# EAGLE design schema (EAGLE 7.7.0)
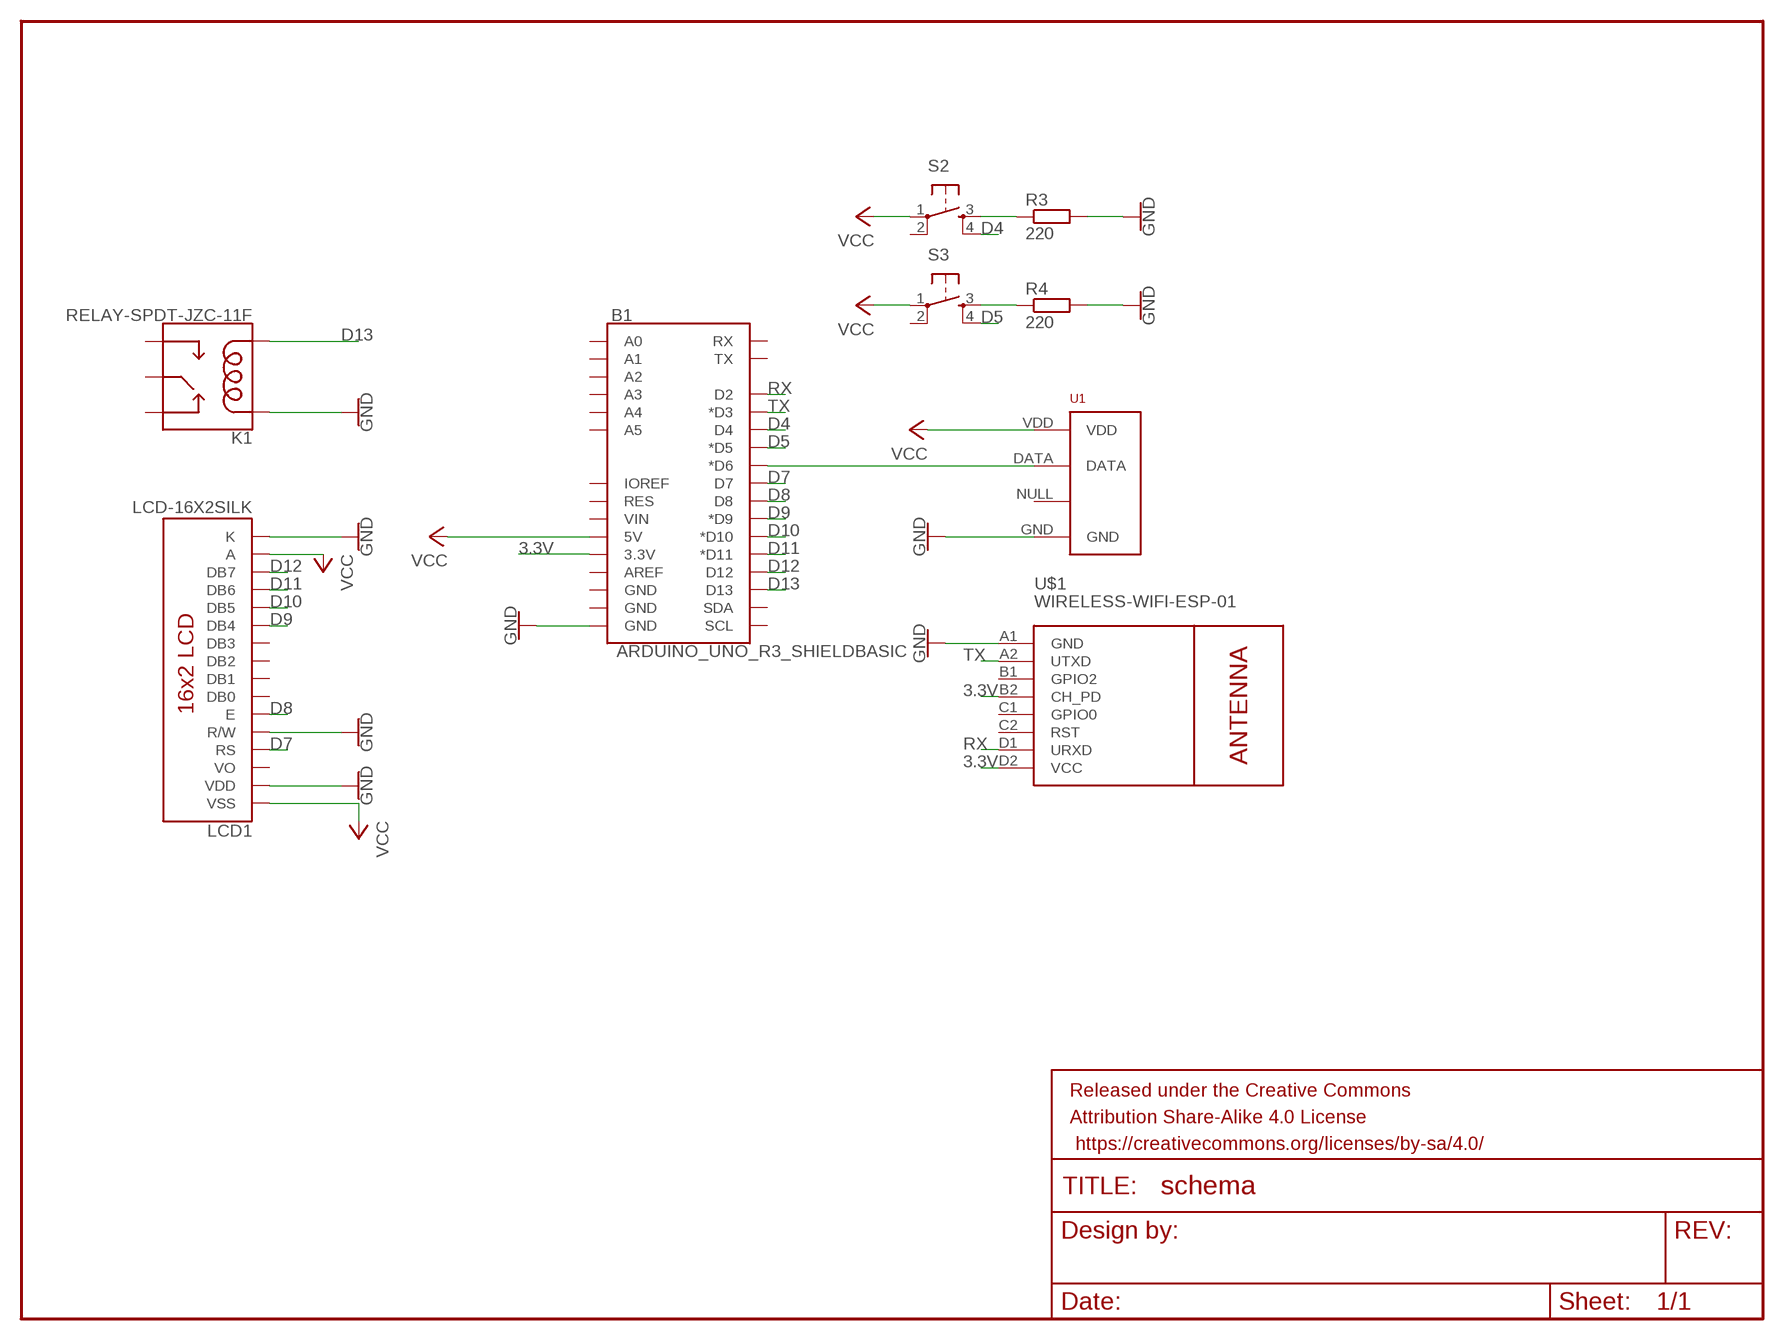
[diagram p0: schematic, sheet 1]

## Parts
B1  ARDUINO_UNO_R3_SHIELDBASIC  [UNO_R3_SHIELD]
FRAME1  FRAME-LETTER  [CREATIVE_COMMONS]
K1  RELAY-SPDT-JZC-11F  [RELAY-JZC]
LCD1  LCD-16X2SILK  [LCD-16X2]
R3  220  R-EU_0204/7  [0204/7]
R4  220  R-EU_0204/7  [0204/7]
S2  TAC_SWITCHPTH  [TACTILE-PTH]
S3  TAC_SWITCHPTH  [TACTILE-PTH]
U1  RHT03_DHT-22_AM2302RA  [RHT03_DHT-22/RA]
U$1  WIRELESS-WIFI-ESP-01  [WIRELESS-WIFI-ESP-01]

## Nets
3.3V: B1.3.3V U$1.B2(CH_PD) U$1.D2(VCC)
D4: B1.D4 S2.4
D5: B1.D5(*D5) S3.4
D7: B1.D7 LCD1.4(RS)
D8: B1.D8 LCD1.6(E)
D9: B1.D9(*D9) LCD1.11(DB4)
D10: B1.D10(*D10) LCD1.12(DB5)
D11: B1.D11(*D11) LCD1.13(DB6)
D12: B1.D12 LCD1.14(DB7)
D13: B1.D13 K1.1(COIL2)
GND: B1.GND@0(GND) K1.5(COIL1) LCD1.2(VDD) LCD1.5(R/W) LCD1.16(K) R3.2 R4.2 U1.GND U$1.A1(GND)
N$2: R3.1 S2.3
N$3: B1.D6(*D6) U1.DATA
N$4: R4.1 S3.3
N$5: S3.1 ; supply symbol labelled VCC
RX: B1.D2 U$1.D1(URXD)
TX: B1.D3(*D3) U$1.A2(UTXD)
VCC: B1.5V LCD1.1(VSS) LCD1.15(A) S2.1 U1.VDD
Unconnected: B1.A0 B1.A1 B1.A2 B1.A3 B1.A4 B1.A5 B1.AREF B1.GND@1(GND) B1.GND@2(GND) B1.IOREF B1.RES B1.RX B1.SCL B1.SDA B1.TX B1.VIN K1.2(NC) K1.3(NO) K1.4(MAIN) LCD1.3(VO) LCD1.7(DB0) LCD1.8(DB1) LCD1.9(DB2) LCD1.10(DB3) S2.2 S3.2 U1.NULL U$1.B1(GPIO2) U$1.C1(GPIO0) U$1.C2(RST)

## Library data of the parts
B1 = SparkFun-Boards:ARDUINO_UNO_R3_SHIELD: Arduino R3 Shield Footprint Shield form compatible with the Arduino Uno R3. SparkFun Products: MG2639 Cellular Shield <https://www.sparkfun.com/products/13120> MIDI Shield <https://www.sparkfun.com/products/12898> R3 Stackable Headers Kit <https://www.sparkfun.com/products/11417>
FRAME1 = SparkFun-Aesthetics:FRAME-LETTER: Schematic Frame - Letter Standard 8.5x11 US Letter frame
K1 = SparkFun-Electromechanical:RELAY-SPDT: SPDT Electromechanical Relay Single-pole, double-throw sealed relays. When current is applied to the coil, it throws a simple changeover switch, terminating the connection from the NC contact to ground and closing the NO contact. Use them to switch high voltage/high current devices. SparkFun Products JQX-15F: Relay SPDT Sealed - 20A <https://www.sparkfun.com/products/10924> (COM-10924) JZC-11F: Relay SPDT Sealed <https://www.sparkfun.com/products/100> (COM-00100); PROD_ID: COMP-09533; SF_SKU: COM-00100
LCD1 = SparkFun-Displays:LCD-16X2: Standard text-only 16x2 parallel input LCD Basic 16 character by 2 line display. Typically utilizes the extremely common HD44780 parallel interface chipset SparkFun Products: Basic 16x2 Green <https://www.sparkfun.com/products/255> Basic 8x2 Green <https://www.sparkfun.com/products/11122>; SF_ID: LCD-00255
R3 R4 = resistor:R-EU_: RESISTOR, European symbol
S2 S3 = SparkFun-Retired:TAC_SWITCH: Momentary Switch Button commonly used for reset or general input. Spark Fun Electronics SKU : COM-00097 SMT- SWCH-08247
U1 = RHT03_DHT-22_AM2302:RHT03_DHT-22_AM2302: RHT03 / DHT-22 / AM2302 Packages and symbol for the RHT03 / DHT-22 relative humidity and temperature sensor. Note: The AM2302 is a wired version of the DHT-22 which typically requires less clearance and is thus provided as a separate package.; PROD_ID: SEN-10167
U$1 = diy-modules:WIRELESS-WIFI-ESP-01: Wireless Wi-Fi ESP-01 Module based on ESP8266 chip Click here to find device on ebay.com <http://www.ebay.com/sch/esp8266+esp+01+transceiver>

## Board
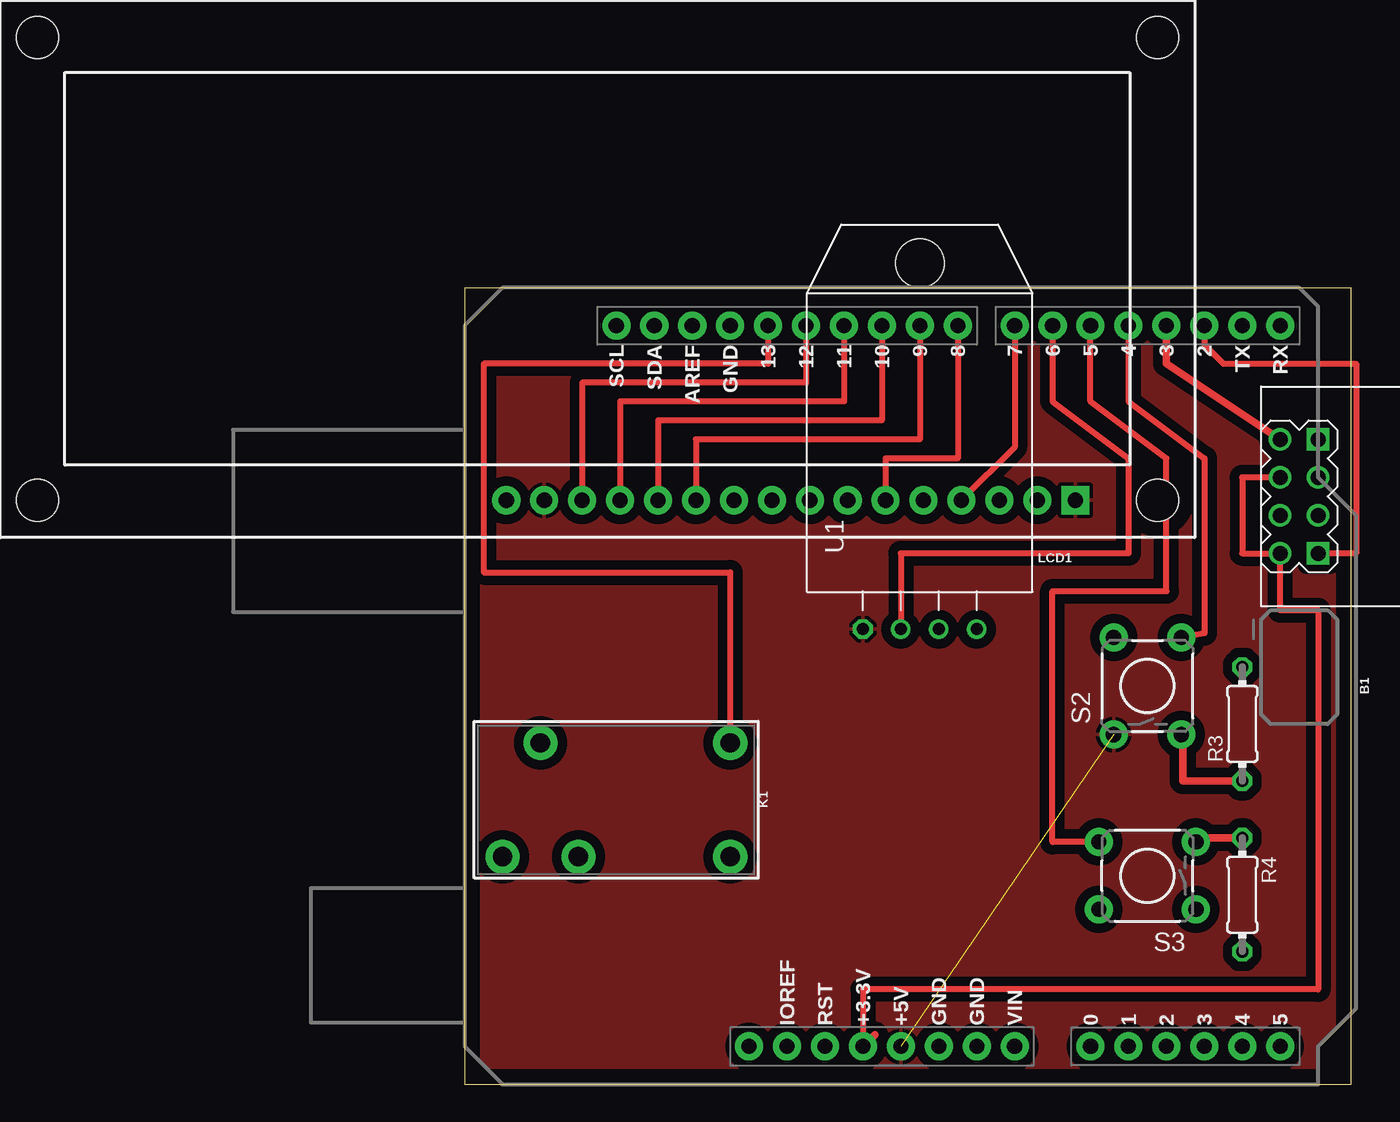
[diagram p1: board, top side]
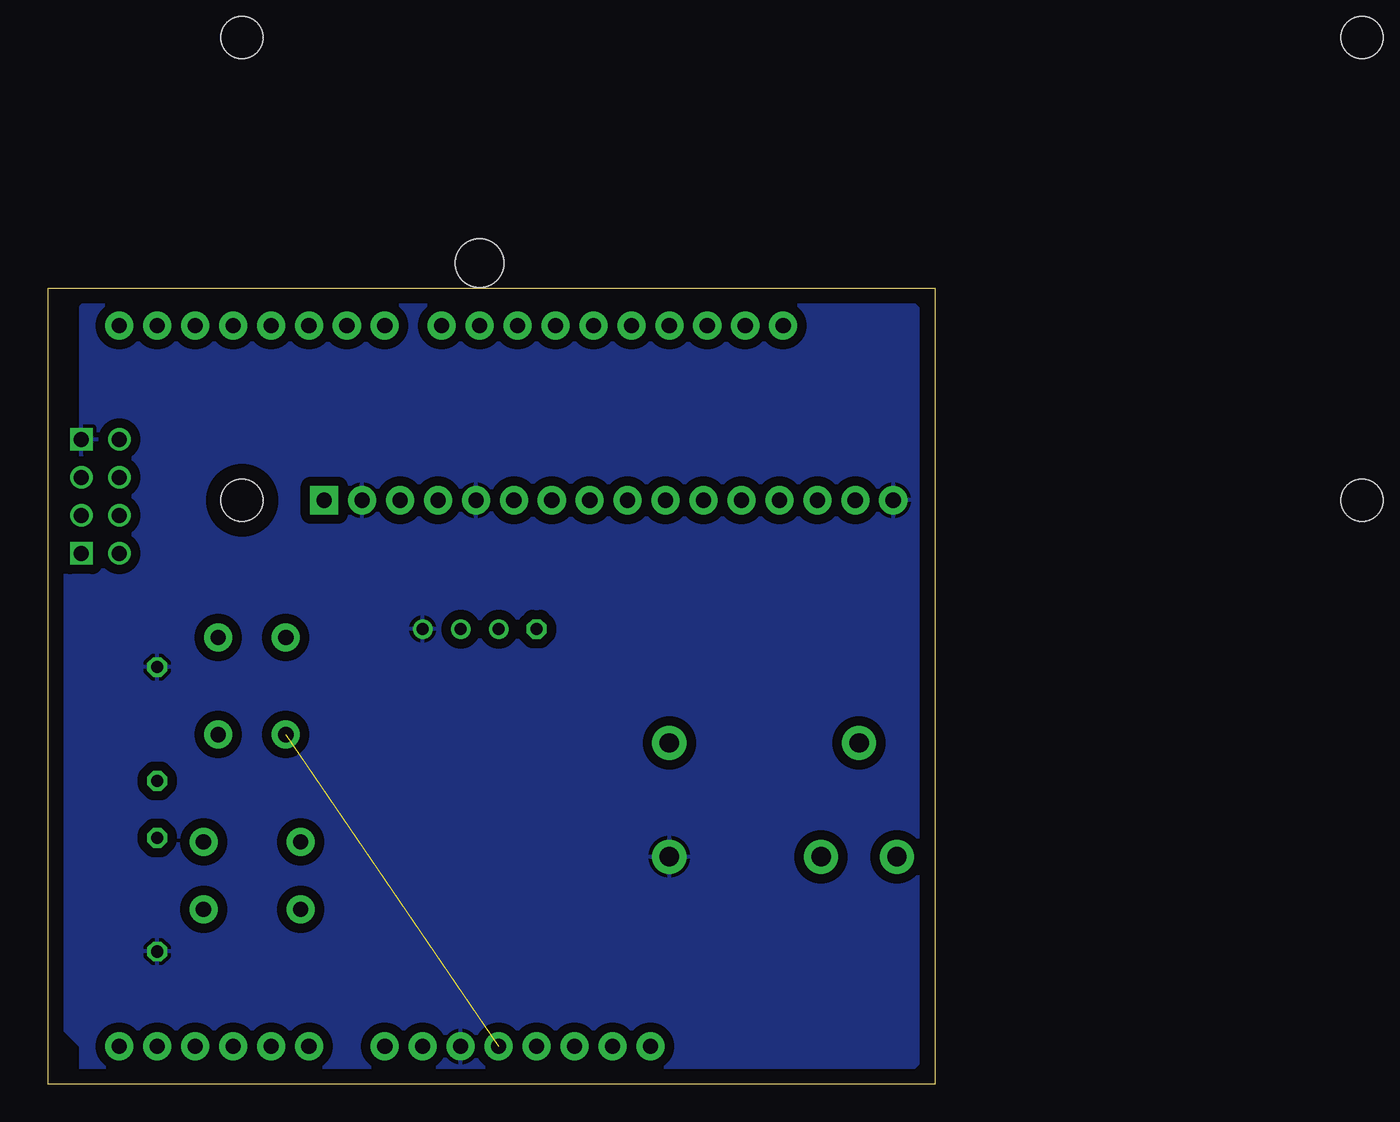
[diagram p2: board, bottom side, seen from below]

Size 59.36 x 53.33 mm. Coordinates in mm from the lower left corner, seen from the top.
Outline: 0,0 59.36,0 59.36,53.33 0,53.33 0,0
Copper layers (1*16): Top 0.035mm / dielectric 1.5mm / Bottom 0.035mm
Design rules "default *": minimum track width 16mil, minimum drill 0.35mm, track to track 25mil, track to pad 25mil, pad to pad 25mil, via to via 25mil, smd to smd 6mil, copper to edge 40mil, drill to drill 6mil, minimum pad ring 10mil, minimum via ring 8mil, stop-mask expansion 4mil, vias tented up to drill 0mil, thermal gap 10mil

### Footprints (pad centres in the part's own frame; a part is rotated, then mirrored left to right if it is on the bottom)
UNO_R3_SHIELD = drill 1.016 pad 1.88: 3.3V 24.13,-2.54; 5V 24.13,0; A0 24.13,12.7; A1 24.13,15.24; A2 24.13,17.78; A3 24.13,20.32; A4 24.13,22.86; A5 24.13,25.4; AREF -24.13,-13.97; D2 -24.13,20.32; D3 -24.13,17.78; D4 -24.13,15.24; D5 -24.13,12.7; D6 -24.13,10.16; D7 -24.13,7.62; D8 -24.13,3.81; D9 -24.13,1.27; D10 -24.13,-1.27; D11 -24.13,-3.81; D12 -24.13,-6.35; D13 -24.13,-8.89; GND@0 24.13,2.54; GND@1 24.13,5.08; GND@2 -24.13,-11.43; IOREF 24.13,-7.62; NC 24.13,-10.16; RES 24.13,-5.08; RX -24.13,25.4; SCL -24.13,-19.05; SDA -24.13,-16.51; TX -24.13,22.86; VIN 24.13,7.62
RELAY-JZC = drill 1.3 pad 2.286: 1 3.81,-8.89; 2 -3.81,1.27; 3 -3.81,6.35; 4 3.81,3.81; 5 -3.81,-8.89
LCD-16X2 = drill 1.016 pad 1.88 square: 1 -32,15.5 | drill 1.016 pad 1.88: 2 -29.46,15.5; 3 -26.92,15.5; 4 -24.38,15.5; 5 -21.84,15.5; 6 -19.3,15.5; 7 -16.76,15.5; 8 -14.22,15.5; 9 -11.68,15.5; 10 -9.14,15.5; 11 -6.6,15.5; 12 -4.06,15.5; 13 -1.52,15.5; 14 1.02,15.5; 15 3.56,15.5; 16 6.1,15.5 | hole 2.8: -37.5,15.5; -37.5,-15.5; 37.5,15.5; 37.5,-15.5
0204/7 = drill 0.813 octagon: 1 -3.81,0; 2 3.81,0
TACTILE-PTH = drill 1.016 pad 1.88: 1 -3.251,2.261; 2 3.251,2.261; 3 -3.251,-2.261; 4 3.251,-2.261
RHT03_DHT-22/RA = drill 0.8: DATA -1.27,0; GND 3.81,0; NULL 1.27,0 | drill 0.8 octagon: VDD -3.81,0 | hole 3.25: 0,24.5
WIRELESS-WIFI-ESP-01 = drill 1 square: A1 -8.89,3.81; D1 -8.89,-3.81 | drill 1: A2 -11.43,3.81; B1 -8.89,1.27; B2 -11.43,1.27; C1 -8.89,-1.27; C2 -11.43,-1.27; D2 -11.43,-3.81

### Placement (x,y rotation side)
B1  29.21,26.67 270 top
FRAME1  -116.84,88.9 0 top  (outside the outline)
K1  8.89,19.05 90 top
LCD1  8.89,54.61 180 top
R3  52.07,24.13 90 top
R4  52.07,12.7 270 top
S2  45.72,26.67 90 top
S3  45.72,13.97 180 top
U1  30.48,30.48 0 top
U$1  66.04,39.37 0 top

### Tracks (layer width: path | path; a pad name or v marks a point on that pad's centre or on a via)
3.3V
  Top 0.406: B1.3.3V 26.67,6.35 57.15,6.35 57.15,31.75 54.61,31.75 U$1.D2 52.07,35.56 52.07,40.64 U$1.B2
  Top 0.508: 27.46,3.33 B1.3.3V
D4
  Top 0.406: B1.D4 44.45,45.72 49.53,41.91 49.53,30.2 S2.4
  Top 0.508: 47.94,30 S2.4
D5
  Top 0.406: S3.4 39.37,16.23 39.37,33.02 46.99,33.02 46.99,41.91 41.91,45.72 B1.D5
D7
  Top 0.406: B1.D7 36.83,42.67 LCD1.4
D8
  Top 0.406: B1.D8 33.02,41.91 28.19,41.91 LCD1.6
D9
  Top 0.406: B1.D9 30.48,43.18 15.49,43.18 LCD1.11
D10
  Top 0.406: B1.D10 27.94,44.45 12.95,44.45 LCD1.12
D11
  Top 0.406: B1.D11 25.4,45.72 10.41,45.72 LCD1.13
D12
  Top 0.406: B1.D12 22.86,46.99 7.87,46.99 LCD1.14
D13
  Top 0.406: B1.D13 20.32,48.26 1.27,48.26 1.27,34.29 17.78,34.29 K1.1
GND
  pour Bottom: 2.54,53.34 0,50.8 0,2.54 2.54,0 57.15,0 57.15,2.54 59.69,5.08 59.69,38.1 57.15,40.64 57.15,52.07 55.88,53.34
N$2
  Top 0.508: R3.1 48.1,20.32 48.1,23.34 S2.3
N$3
  Top 0.406: B1.D6 39.37,45.72 44.45,41.91 44.45,35.56 29.21,35.56 U1.DATA
N$4
  Top 0.508: R4.1 49.05,16.51 49.05,16.35 S3.3
RX
  Top 0.406: B1.D2 49.53,49.53 50.8,48.26 59.69,48.26 59.69,35.56 U$1.D1
TX
  Top 0.508: U$1.A2 46.99,48.26 B1.D3
VCC  (1 unrouted)
  pour Top: 0,2.54 2.54,0 57.15,0 57.15,2.54 59.69,5.08 59.69,38.1 57.15,40.64 57.15,52.07 55.88,53.34 2.54,53.34 0,50.8